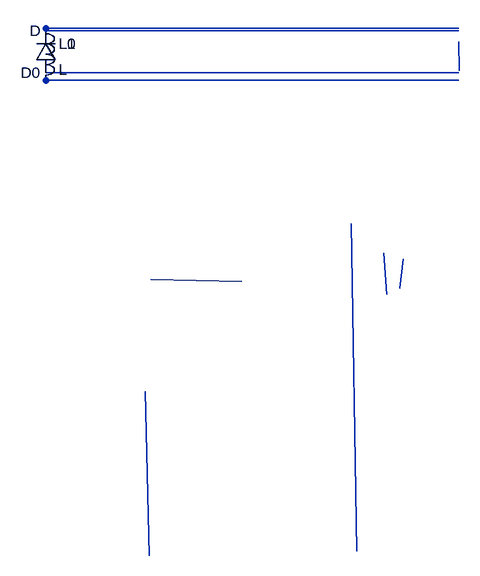
[diagram p0: schematic try1..asc]
try1..asc, the LTspice schematic file:
Version 4
SHEET 1 880 680
WIRE -1 -17 634 -17
WIRE -1 47 634 47
WIRE -1 -21 634 -21
WIRE -1 59 634 59
WIRE -1 -21 634 -21
WIRE -1 59 634 59
WIRE 158 791 152 538
WIRE 549 334 543 380
WIRE 523 389 519 325
WIRE 300 369 160 366
WIRE 469 280 477 784
WIRE 634 0 635 44
SYMBOL diode 15 47 R180
SYMATTR InstName D0
SYMBOL ind -17 -37 R0
SYMATTR InstName L0
SYMBOL ind -17 -37 R0
SYMATTR InstName L1

The netlist it stands for:
* try1..asc
D0 N002 N001 D
L0 N003 N004 L
L1 N003 N004 L
.model D D
.lib standard.dio
.backanno
.end